# EAGLE design fm_receiver_schematic (EAGLE 9.6.2)
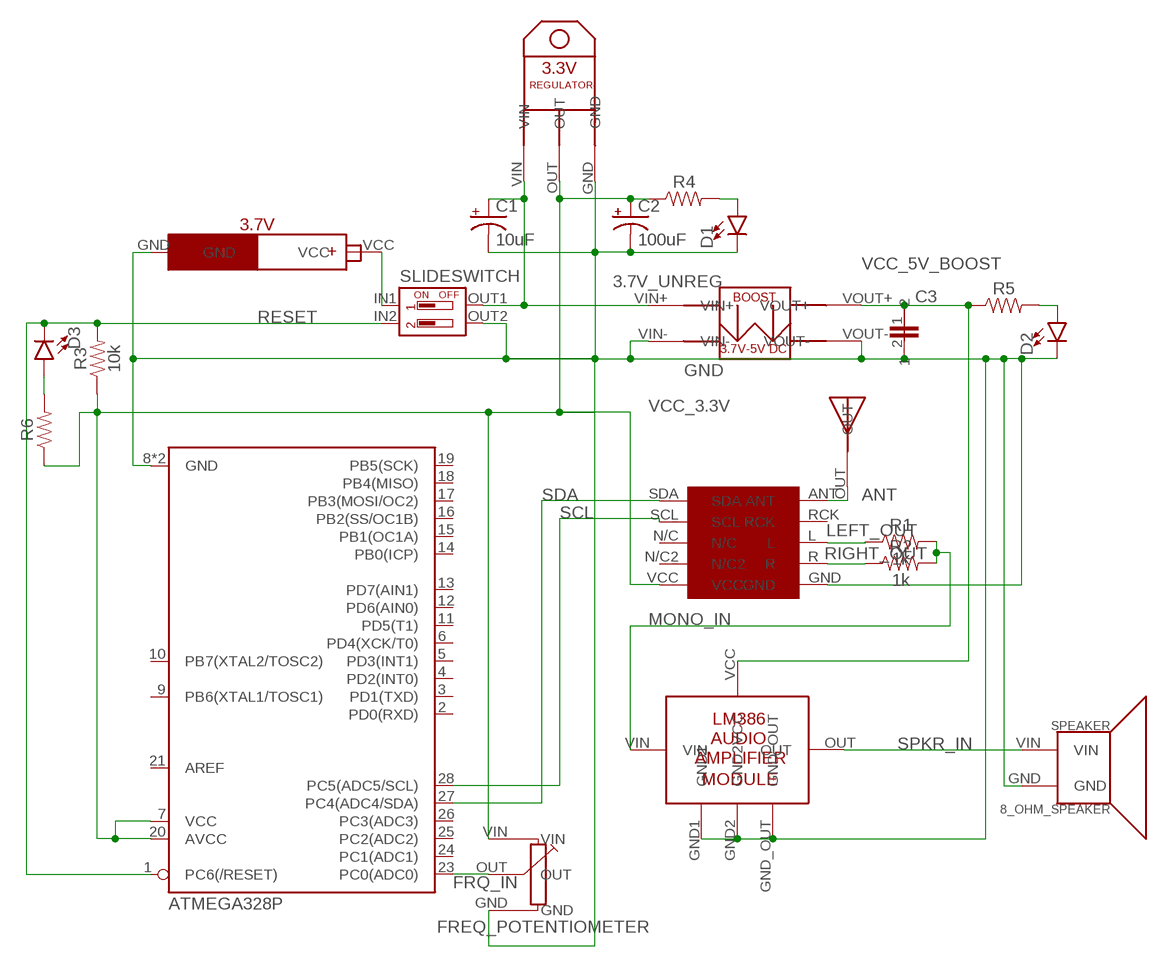
[diagram p0: schematic, sheet 1]

## Parts
3.3V_REGULATOR  LDO_REG_3.3V  [LDO_REG_3.3V]
3.7_5_BOOST  3.7V_5V_BOOST_CONV  [3.7V_5V_BOOST_CONV]
ANTENNA  SIMPLE_ANTENNA  [SIMPLE_ANTENNA]
ATMEGA328P  328P  ATMEGA328P_PDIP  [DIP28]
C1  10uF  10UF-POLAR-RADIAL-2.5MM-25V-20%  [CPOL-RADIAL-2.5MM-5MM]
C2  100uF  100UF-POLAR-RADIAL-2.5MM-25V-20%  [CPOL-RADIAL-2.5MM-6.5MM]
C3  0.1UF_CER_CAP  [0.1UF_CER_CAP]
D1  LED5MM  [LED_5MM]
D2  LED5MM  [LED_5MM]
D3  LED5MM  [LED_5MM]
FM_RECEIVER  RDA  [RDA]
FREQ_POTENTIOMETER  POTENTIOMETER_LARGE  [POTENTIOMETER_LARGE]
LM386_MODULE  LM386_AUDIO_AMP_MODULE  [LM386_AUDIO_AMP_MODULE]
PWR_SUPPLY  3.7V_PWR_DESIGNATOR  [3.7V_PWR_DESIGNATOR]
R1  1k  1KOHM-HORIZ-1/4W-1%  [AXIAL-0.3]
R2  1k  1KOHM-HORIZ-1/4W-1%  [AXIAL-0.3]
R3  10k  10KOHM-HORIZ-1/4W-1%  [AXIAL-0.3]
R4  RESISTORAXIAL-0.3  [AXIAL-0.3]
R5  RESISTORAXIAL-0.3  [AXIAL-0.3]
R6  RESISTORAXIAL-0.3  [AXIAL-0.3]
SLIDESWITCH  2_WAY_DIP_PWR_RST_SLIDESWITCH  [2_WAY_DIP_PWR_RST_SLIDESWITCH]
SPEAKER  8_OHM_SPEAKER  [8_OHM_SPEAKER]

## Nets
3.7V_UNREG: 3.3V_REGULATOR.VIN 3.7_5_BOOST.VIN+ C1.1(+) SLIDESWITCH.OUT1
ANT: ANTENNA.OUT FM_RECEIVER.ANT
FRQ_IN: ATMEGA328P.23(PC0(ADC0)) FREQ_POTENTIOMETER.OUT
GND: 3.3V_REGULATOR.GND 3.7_5_BOOST.VIN- 3.7_5_BOOST.VOUT- ATMEGA328P.8(GND) ATMEGA328P.22(GND) C1.2(-) C2.2(-) C3.2 D1.K(C) D2.K(C) FM_RECEIVER.GND FREQ_POTENTIOMETER.GND LM386_MODULE.GND1 LM386_MODULE.GND2 LM386_MODULE.GND_OUT PWR_SUPPLY.GND SLIDESWITCH.OUT2 SPEAKER.GND
LEFT_OUT: FM_RECEIVER.L R1.P$1
MONO_IN: LM386_MODULE.VIN R1.P$2 R2.P$2
N$1: PWR_SUPPLY.VCC SLIDESWITCH.IN1
N$8: D1.A R4.P$2
N$11: D2.A R5.P$2
N$12: D3.A R6.P$2
RESET: ATMEGA328P.1(PC6(/RESET)) D3.K(C) R3.P$2 SLIDESWITCH.IN2
RIGHT_OUT: FM_RECEIVER.R R2.P$1
SCL: ATMEGA328P.28(PC5(ADC5/SCL)) FM_RECEIVER.SCL
SDA: ATMEGA328P.27(PC4(ADC4/SDA)) FM_RECEIVER.SDA
SPKR_IN: LM386_MODULE.OUT SPEAKER.VIN
VCC_3.3V: 3.3V_REGULATOR.OUT ATMEGA328P.7(VCC) ATMEGA328P.20(AVCC) C2.1(+) FM_RECEIVER.VCC FREQ_POTENTIOMETER.VIN R3.P$1 R4.P$1 R6.P$1
VCC_5V_BOOST: 3.7_5_BOOST.VOUT+ C3.1 LM386_MODULE.VCC R5.P$1
Unconnected: ATMEGA328P.2(PD0(RXD)) ATMEGA328P.3(PD1(TXD)) ATMEGA328P.4(PD2(INT0)) ATMEGA328P.5(PD3(INT1)) ATMEGA328P.6(PD4(XCK/T0)) ATMEGA328P.9(PB6(XTAL1/TOSC1)) ATMEGA328P.10(PB7(XTAL2/TOSC2)) ATMEGA328P.11(PD5(T1)) ATMEGA328P.12(PD6(AIN0)) ATMEGA328P.13(PD7(AIN1)) ATMEGA328P.14(PB0(ICP)) ATMEGA328P.15(PB1(OC1A)) ATMEGA328P.16(PB2(SS/OC1B)) ATMEGA328P.17(PB3(MOSI/OC2)) ATMEGA328P.18(PB4(MISO)) ATMEGA328P.19(PB5(SCK)) ATMEGA328P.21(AREF) ATMEGA328P.24(PC1(ADC1)) ATMEGA328P.25(PC2(ADC2)) ATMEGA328P.26(PC3(ADC3)) FM_RECEIVER.N/C FM_RECEIVER.N/C2 FM_RECEIVER.RCK

## Library data of the parts
3.3V_REGULATOR = hridhay_components:LDO_REG_3.3V: 3.3V 1 mil pitch LDO Voltage Regulator
3.7_5_BOOST = hridhay_components:3.7V_5V_BOOST_CONV
ANTENNA = hridhay_components:SIMPLE_ANTENNA
ATMEGA328P = SparkFun-IC-Microcontroller:ATMEGA328P_PDIP: Atmel 328P Through hole ATMEGA328P uC used in the Arduino 32kb flash, 1k EEPROM, 2k SRAM Datasheet <http://www.sparkfun.com/datasheets/Components/SMD/ATMega328.pdf> SparkFun Products Storefront component: AVR 28 Pin 20MHz 32K 6A/D - ATMega328P <https://www.sparkfun.com/products/9061> (COM-09061) SparkFun Simon Says - Through-Hole Soldering Kit <https://www.sparkfun.com/products/10547> (KIT-10547) SparkFun Learn to Solder - Simon Says <https://www.sparkfun.com/products/13708> (KIT-13708) SparkFun BigTime Watch Kit <https://www.sparkfun.com/products/11734> (KIT-11734) SparkFun ClockIt <https://www.sparkfun.com/products/10930> (KIT-10930) SparkFun Serial Enabled LCD Kit <https://www.sparkfun.com/products/10097> (LCD-10097) SparkFun Simon Tilts - Through Hole Soldering Kit <https://www.sparkfun.com/products/12634> (KIT-12634) SparkFun Frequency Counter Kit <https://www.sparkfun.com/products/10140> (KIT-10140) FabFM Radio Kit <https://www.sparkfun.com/products/11043> (KIT-11043) SparkFun Binary Blaster Kit <https://www.sparkfun.com/products/12037> (KIT-12037) SparkFun Metro-Gnome <https://www.sparkfun.com/products/9236> (KIT-09236) ATmega328 with Arduino Optiboot (Uno) <https://www.sparkfun.com/products/10524> (DEV-10524); PROD_ID: IC-09136
C1 = SparkFun-Capacitors:10UF-POLAR: 10.0µF polarized capacitors A capacitor is a passive two-terminal electrical component used to store electrical energy temporarily in an electric field.; PROD_ID: CAP-08440
C2 = SparkFun-Capacitors:100UF-POLAR: 100µF polarized capacitors A capacitor is a passive two-terminal electrical component used to store electrical energy temporarily in an electric field.; PROD_ID: CAP-08439
C3 = hridhay_components:0.1UF_CER_CAP
D1-D3 = SparkFun-LED:LED: LED (Generic) Standard schematic elements and footprints for 5mm, 3mm, 1206, and 0603 sized LEDs. Generic LEDs with no color specified.
FM_RECEIVER = RDA:RDA
FREQ_POTENTIOMETER = hridhay_components:POTENTIOMETER_LARGE: This is a 100k large potentiometer, with pitch 2 mils between its pins
LM386_MODULE = hridhay_components:LM386_AUDIO_AMP_MODULE
PWR_SUPPLY = hridhay_components:3.7V_PWR_DESIGNATOR
R1 R2 = SparkFun-Resistors:1KOHM: 1kΩ resistor A resistor is a passive two-terminal electrical component that implements electrical resistance as a circuit element. Resistors act to reduce current flow, and, at the same time, act to lower voltage levels within circuits. - Wikipedia; PROD_ID: RES-12182
R3 = SparkFun-Resistors:10KOHM: 10kΩ resistor A resistor is a passive two-terminal electrical component that implements electrical resistance as a circuit element. Resistors act to reduce current flow, and, at the same time, act to lower voltage levels within circuits. - Wikipedia; PROD_ID: RES-12183
R4-R6 = SparkFun-Resistors:RESISTOR: Generic Resistor Package
SLIDESWITCH = hridhay_components:2_WAY_DIP_PWR_RST_SLIDESWITCH: Double Pole Single Throw Switch, Breadboard Friendly
SPEAKER = hridhay_components:8_OHM_SPEAKER

## Board
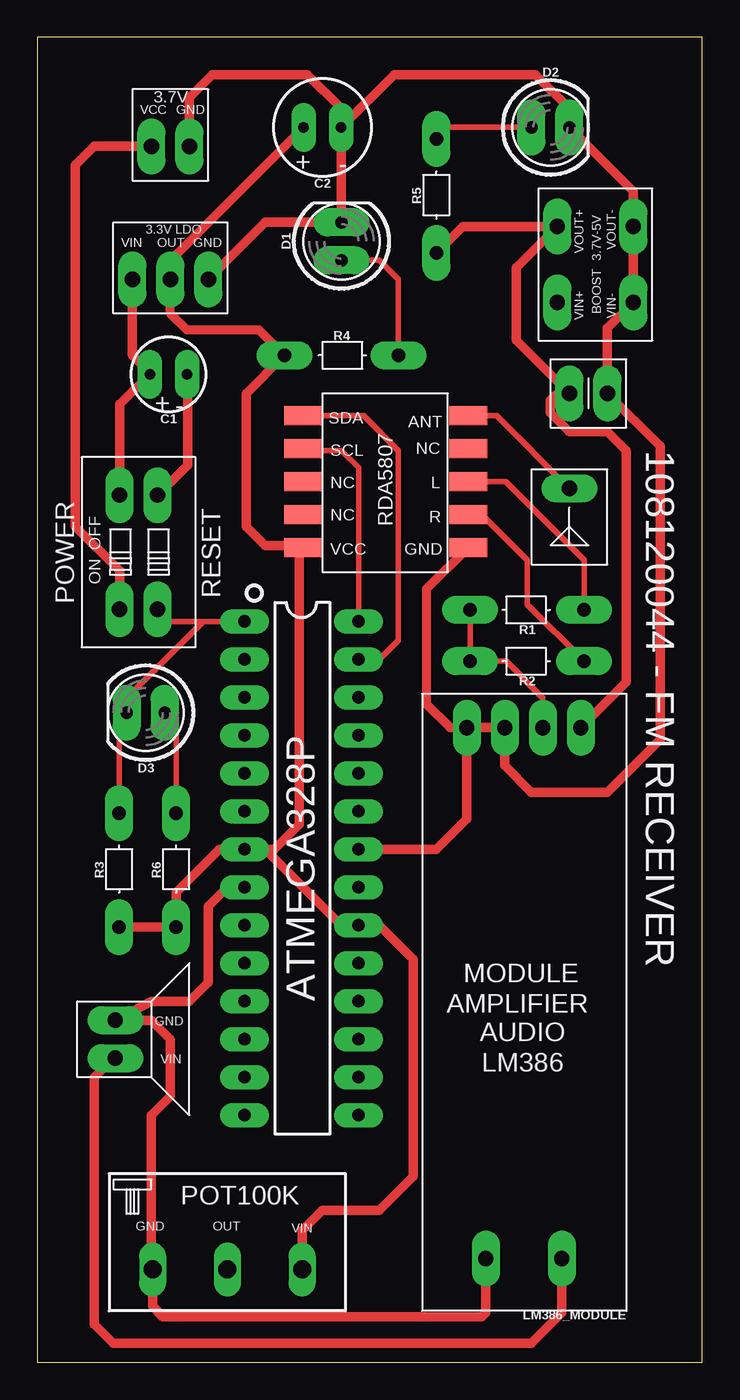
[diagram p1: board, top side]
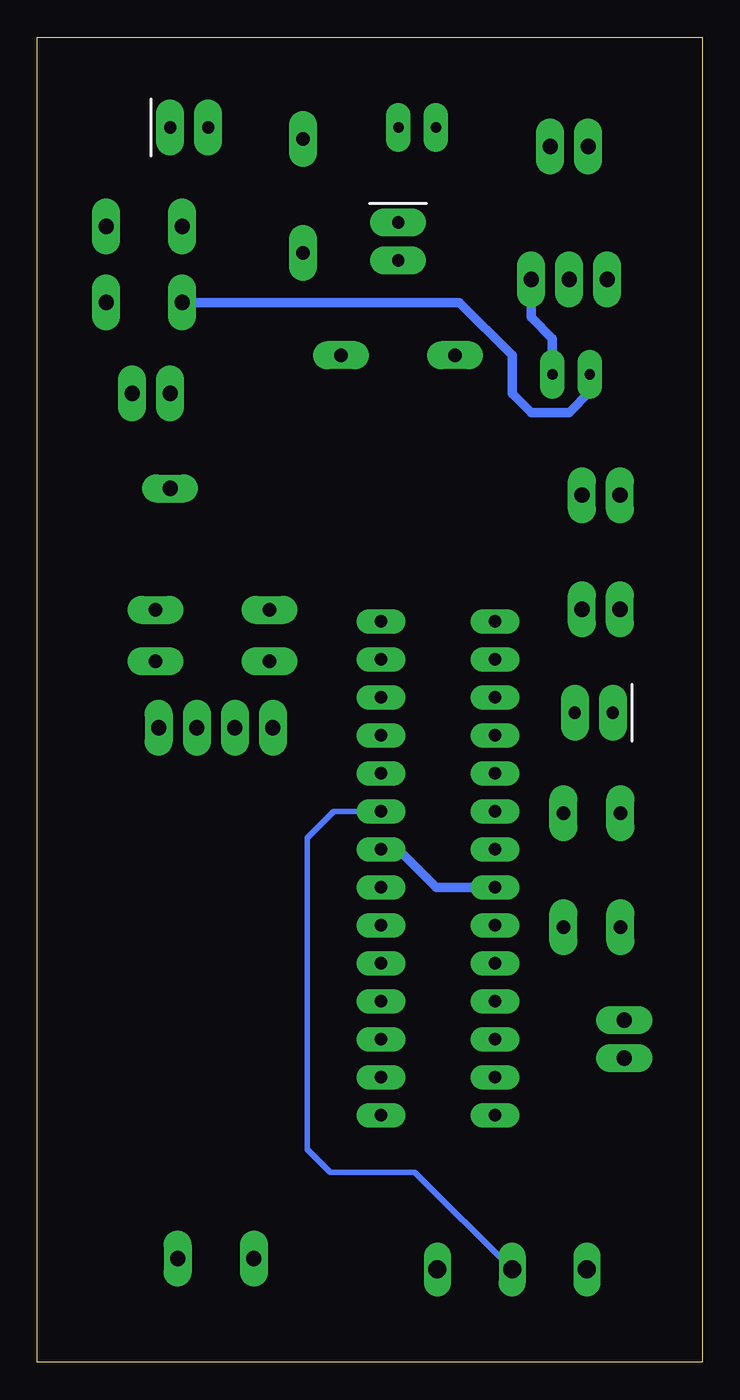
[diagram p2: board, bottom side, seen from below]

Size 44.43 x 88.57 mm. Coordinates in mm from the lower left corner, seen from the top.
Outline: 0,0 44.43,0 44.43,88.57 0,88.57 0,0
Copper layers (1*16): Top 0.035mm / dielectric 1.5mm / Bottom 0.035mm
Design rules "SparkFun": minimum track width 8mil, minimum drill 20mil, track to track 8mil, track to pad 8mil, pad to pad 8mil, via to via 8mil, smd to smd 8mil, copper to edge 8mil, drill to drill 8mil, minimum pad ring 12mil, minimum via ring 10mil, stop-mask expansion 4mil, vias tented up to drill 20mil, thermal gap 10mil

### Footprints (pad centres in the part's own frame; a part is rotated, then mirrored left to right if it is on the bottom)
LDO_REG_3.3V = drill 1.016 pad 1.88 long: GND 5.08,0; OUT 2.54,0; VIN 0,0
3.7V_5V_BOOST_CONV = drill 1.016 pad 1.88 long: VIN+ 5.08,-5.08; VIN- 5.08,0; VOUT+ 0,-5.08; VOUT- 0,0
SIMPLE_ANTENNA = drill 1.016 pad 1.88 long: OUT 0,0
DIP28 = drill 0.813 pad 1.626 long: 1 -16.51,-3.81; 2 -13.97,-3.81; 3 -11.43,-3.81; 4 -8.89,-3.81; 5 -6.35,-3.81; 6 -3.81,-3.81; 7 -1.27,-3.81; 8 1.27,-3.81; 9 3.81,-3.81; 10 6.35,-3.81; 11 8.89,-3.81; 12 11.43,-3.81; 13 13.97,-3.81; 14 16.51,-3.81; 15 16.51,3.81; 16 13.97,3.81; 17 11.43,3.81; 18 8.89,3.81; 19 6.35,3.81; 20 3.81,3.81; 21 1.27,3.81; 22 -1.27,3.81; 23 -3.81,3.81; 24 -6.35,3.81; 25 -8.89,3.81; 26 -11.43,3.81; 27 -13.97,3.81; 28 -16.51,3.81
CPOL-RADIAL-2.5MM-5MM = drill 0.7 pad 1.651 long: 1 1.25,0; 2 -1.25,0
CPOL-RADIAL-2.5MM-6.5MM = drill 0.7 pad 1.651 long: 1 1.25,0; 2 -1.25,0
0.1UF_CER_CAP = drill 1.016 pad 1.88 long: 1 0,0; 2 2.54,0
LED_5MM = drill 0.813 pad 1.88 long: A -1.27,0; K 1.27,0
RDA = smd 2.54 x 1.27: ANT 11,-1.5; GND 11,-10.3; L 11,-5.9; N/C 0,-5.9; N/C2 0,-8.1; R 11,-8.1; RCK 11,-3.7; SCL 0,-3.7; SDA 0,-1.5; VCC 0,-10.3
POTENTIOMETER_LARGE = drill 1.2 long: GND 5,6.5; OUT 0,6.5; VIN -5,6.5
LM386_AUDIO_AMP_MODULE = drill 1.016 pad 1.88 long: GND1 8.13,0; GND2 10.67,0; GND_OUT 9.4,35.5; OUT 4.32,35.5; VCC 3.05,0; VIN 5.59,0
3.7V_PWR_DESIGNATOR = drill 1.016 pad 1.88 long: GND 2.54,0; VCC 0,0
AXIAL-0.3 = drill 0.9 pad 1.88 long: P$1 -3.81,0; P$2 3.81,0
2_WAY_DIP_PWR_RST_SLIDESWITCH = drill 1.016 pad 1.88 long: IN1 0,0; IN2 2.54,0; OUT1 0,7.62; OUT2 2.54,7.62
8_OHM_SPEAKER = drill 1.016 pad 1.88 long: GND 1.143,-2.54; VIN 1.143,0

### Placement (x,y rotation side)
3.3V_REGULATOR  6.35,72.39 0 top
3.7_5_BOOST  39.83,75.93 270 top
ANTENNA  35.56,58.42 180 top
ATMEGA328P  17.65,33.02 270 top
C1  8.76,66.04 180 top
C2  19.05,82.55 180 top
C3  35.56,64.77 0 top
D1  20.32,74.93 90 top
D2  34.29,82.55 0 top
D3  7.24,43.42 180 top
FM_RECEIVER  17.78,64.77 0 top
FREQ_POTENTIOMETER  12.7,12.7 180 top
LM386_MODULE  39.37,42.42 180 top
PWR_SUPPLY  7.62,81.28 0 top
R1  32.73,50.29 180 top
R2  32.73,46.86 180 top
R3  5.46,32.89 90 top
R4  20.32,67.31 0 top
R5  26.67,77.97 90 top
R6  9.27,32.89 90 top
SLIDESWITCH  5.49,50.34 0 top
SPEAKER  6.35,20.32 180 top

### Tracks (layer width: path | path; a pad name or v marks a point on that pad's centre or on a via)
3.7V_UNREG
  Top 0.381: 5.51,57.98 SLIDESWITCH.OUT1 | C1.1 7.51,66.15
  Top 0.635: C1.1 5.51,64.04 5.51,57.98 | 7.51,66.15 6.35,67.31 3.3V_REGULATOR.VIN
  Bottom 0.381: 7.51,64.88 C1.1
  Bottom 0.635: 3.7_5_BOOST.VIN+ 16.24,70.85 12.7,67.31 12.7,64.77 11.43,63.5 8.89,63.5 7.51,64.88
ANT
  Top 0.381: FM_RECEIVER.ANT 30.71,63.27 ANTENNA.OUT
FRQ_IN
  Bottom 0.381: FREQ_POTENTIOMETER.OUT 19.2,12.7 24.86,12.7 26.4,14.24 26.4,35.06 24.63,36.83 ATMEGA328P.23
GND
  Top 0.381: 7.62,6.28 FREQ_POTENTIOMETER.GND | C2.2 20.32,82.53
  Top 0.61: FM_RECEIVER.GND 26,51.69 26,44 27.58,42.42 LM386_MODULE.GND2
  Top 0.635: 7.62,6.28 7.62,16.51 8.89,17.78 8.89,21.59 7.62,22.86 SPEAKER.GND 7.62,24.13 10.16,24.13 11.43,25.4 11.43,30.48 12.7,31.75 ATMEGA328P.8 | FREQ_POTENTIOMETER.GND 7.7,3.73 8.39,3.04 29.71,3.04 29.97,3.3 LM386_MODULE.GND_OUT | ATMEGA328P.22 26.67,34.29 28.7,36.32 LM386_MODULE.GND2 LM386_MODULE.GND1 31.24,39.88 33.02,38.1 38.1,38.1 41.64,41.64 41.64,61.23 C3.2 38.1,69.12 3.7_5_BOOST.VIN- 3.7_5_BOOST.VOUT- 39.83,78.28 D2.K 35.56,83.82 33.29,86.09 23.84,86.09 C2.2 | PWR_SUPPLY.GND 10.16,84.55 11.7,86.09 18.05,86.09 20.32,83.82 20.32,82.53 D1.K 15.24,76.2 3.3V_REGULATOR.GND | SLIDESWITCH.OUT2 10.03,59.96 10.03,66.02 C1.2
  Bottom 0.635: 3.3V_REGULATOR.GND 11.43,69.85 10.01,68.43 C1.2 | ATMEGA328P.8 17.78,31.75 20.32,34.29 ATMEGA328P.22
LEFT_OUT
  Top 0.381: R1.P$1 36.54,53.63 31.3,58.87 FM_RECEIVER.L
MONO_IN
  Top 0.381: R1.P$2 R2.P$2 31.34,46.86 33.78,44.42 LM386_MODULE.VIN
N$1
  Top 0.635: SLIDESWITCH.IN1 5.49,52.93 2.54,55.88 2.54,80.01 3.81,81.28 PWR_SUPPLY.VCC
N$8
  Top 0.381: D1.A 22.86,73.66 24.13,72.39 R4.P$2
N$11
  Top 0.381: R5.P$2 27.44,82.55 D2.A
N$12
  Top 0.381: D3.A 9.27,42.66 R6.P$2
RESET
  Top 0.381: R3.P$2 5.46,42.91 D3.K 5.97,44.42 11.08,49.53 ATMEGA328P.1 8.84,49.53 SLIDESWITCH.IN2
RIGHT_OUT
  Top 0.381: R2.P$1 32.75,50.65 32.75,53.61 29.69,56.67 FM_RECEIVER.R
SCL
  Top 0.381: FM_RECEIVER.SCL 17.89,60.96 20.32,60.96 21.46,59.82 ATMEGA328P.28
SDA
  Top 0.381: FM_RECEIVER.SDA 21.82,63.27 24.13,60.96 24.13,48.26 22.86,46.99 ATMEGA328P.27
SPKR_IN
  Top 0.635: LM386_MODULE.OUT 35.05,3.3 33.02,1.27 5.08,1.27 3.81,2.54 3.81,19.05 5.08,20.32 SPEAKER.VIN
VCC_3.3V
  Top 0.381: 21.59,29.21 ATMEGA328P.20 | 17.64,54.61 FM_RECEIVER.VCC
  Top 0.61: R4.P$1 14.82,69 10,69 8.89,70.11 3.3V_REGULATOR.OUT
  Top 0.635: FREQ_POTENTIOMETER.VIN 17.7,8.81 19.05,10.16 22.86,10.16 25.13,12.43 25.13,26.94 22.86,29.21 21.59,29.21 | R3.P$1 R6.P$1 9.27,31.4 12.16,34.29 ATMEGA328P.7 | R4.P$1 13.97,64.77 13.97,55.88 15.24,54.61 17.64,54.61 | ATMEGA328P.7 15.84,34.29 17.51,35.96 17.51,54.2 FM_RECEIVER.VCC | C2.1 8.89,73.64 3.3V_REGULATOR.OUT | ATMEGA328P.7 15.24,34.29 20.32,29.21 ATMEGA328P.20
VCC_5V_BOOST
  Top 0.635: R5.P$1 28.44,75.93 3.7_5_BOOST.VOUT+ 32,73.18 32,68.33 35.33,65 | LM386_MODULE.VCC 39.37,45.47 39.37,60.96 38.1,62.23 35.56,62.23 34.29,63.5 34.29,64.29 35,65 35.33,65 | 35.33,65 C3.1

### Text on the board
tPlace: 108120044 - FM RECEIVER | ATMEGA328P